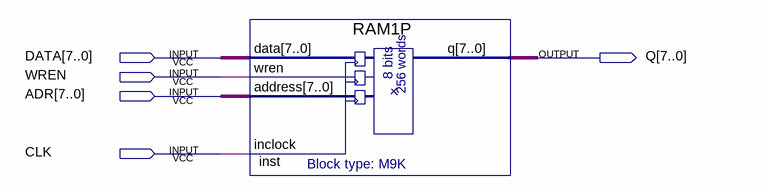
[diagram p0: schematic sheet]
// Quartus schematic RAM.bdf as structural Verilog: 1 symbols, 5 pins
module RAM (
  input  [7:0] DATA,
  input  WREN,
  input  [7:0] ADR,
  input  CLK,
  output [7:0] Q
);

  RAM1P inst (.data(DATA), .wren(WREN), .address(ADR), .inclock(CLK), .q(Q));
endmodule
